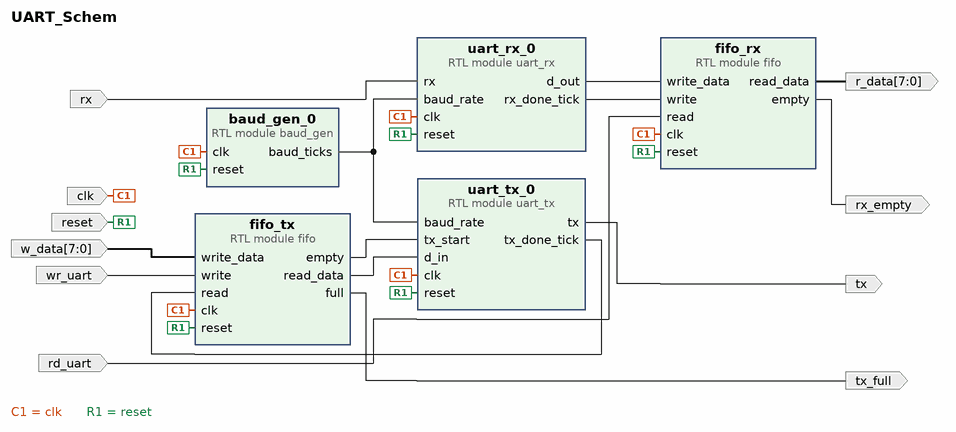
[diagram p0: block diagram of the top level]
# Vivado block design UART_Schem, xc7z020clg400-1, Vivado 2021.2
create_bd_design UART_Schem

create_bd_port -dir I rd_uart
create_bd_port -dir I rx
create_bd_port -dir I clk
create_bd_port -dir I reset
create_bd_port -dir I wr_uart
create_bd_port -dir I -from 7 -to 0 w_data
create_bd_port -dir O rx_empty
create_bd_port -dir O -from 7 -to 0 r_data
create_bd_port -dir O tx_full
create_bd_port -dir O tx

create_bd_cell -type module -reference baud_gen baud_gen_0
create_bd_cell -type module -reference uart_rx uart_rx_0
create_bd_cell -type module -reference uart_tx uart_tx_0
create_bd_cell -type module -reference fifo fifo_rx
create_bd_cell -type module -reference fifo fifo_tx

# ---- connections ----

connect_bd_net [get_bd_pins baud_gen_0/baud_ticks] [get_bd_pins uart_rx_0/baud_rate] [get_bd_pins uart_tx_0/baud_rate]
connect_bd_net [get_bd_ports clk] \
  [get_bd_pins uart_rx_0/clk] [get_bd_pins baud_gen_0/clk] [get_bd_pins uart_tx_0/clk] [get_bd_pins fifo_tx/clk] \
  [get_bd_pins fifo_rx/clk]
connect_bd_net [get_bd_pins fifo_rx/empty] [get_bd_ports rx_empty]
connect_bd_net [get_bd_pins fifo_rx/read_data] [get_bd_ports r_data]
connect_bd_net [get_bd_pins fifo_tx/empty] [get_bd_pins uart_tx_0/tx_start]
connect_bd_net [get_bd_pins fifo_tx/full] [get_bd_ports tx_full]
connect_bd_net [get_bd_pins fifo_tx/read_data] [get_bd_pins uart_tx_0/d_in]
connect_bd_net [get_bd_ports rd_uart] [get_bd_pins fifo_rx/read]
connect_bd_net [get_bd_ports reset] \
  [get_bd_pins baud_gen_0/reset] [get_bd_pins fifo_tx/reset] [get_bd_pins uart_rx_0/reset] [get_bd_pins uart_tx_0/reset] \
  [get_bd_pins fifo_rx/reset]
connect_bd_net [get_bd_ports rx] [get_bd_pins uart_rx_0/rx]
connect_bd_net [get_bd_pins uart_rx_0/d_out] [get_bd_pins fifo_rx/write_data]
connect_bd_net [get_bd_pins uart_rx_0/rx_done_tick] [get_bd_pins fifo_rx/write]
connect_bd_net [get_bd_pins uart_tx_0/tx] [get_bd_ports tx]
connect_bd_net [get_bd_pins uart_tx_0/tx_done_tick] [get_bd_pins fifo_tx/read]
connect_bd_net [get_bd_ports w_data] [get_bd_pins fifo_tx/write_data]
connect_bd_net [get_bd_ports wr_uart] [get_bd_pins fifo_tx/write]

validate_bd_design
save_bd_design
